# EAGLE schematic esp_test (EAGLE 7.7.0)
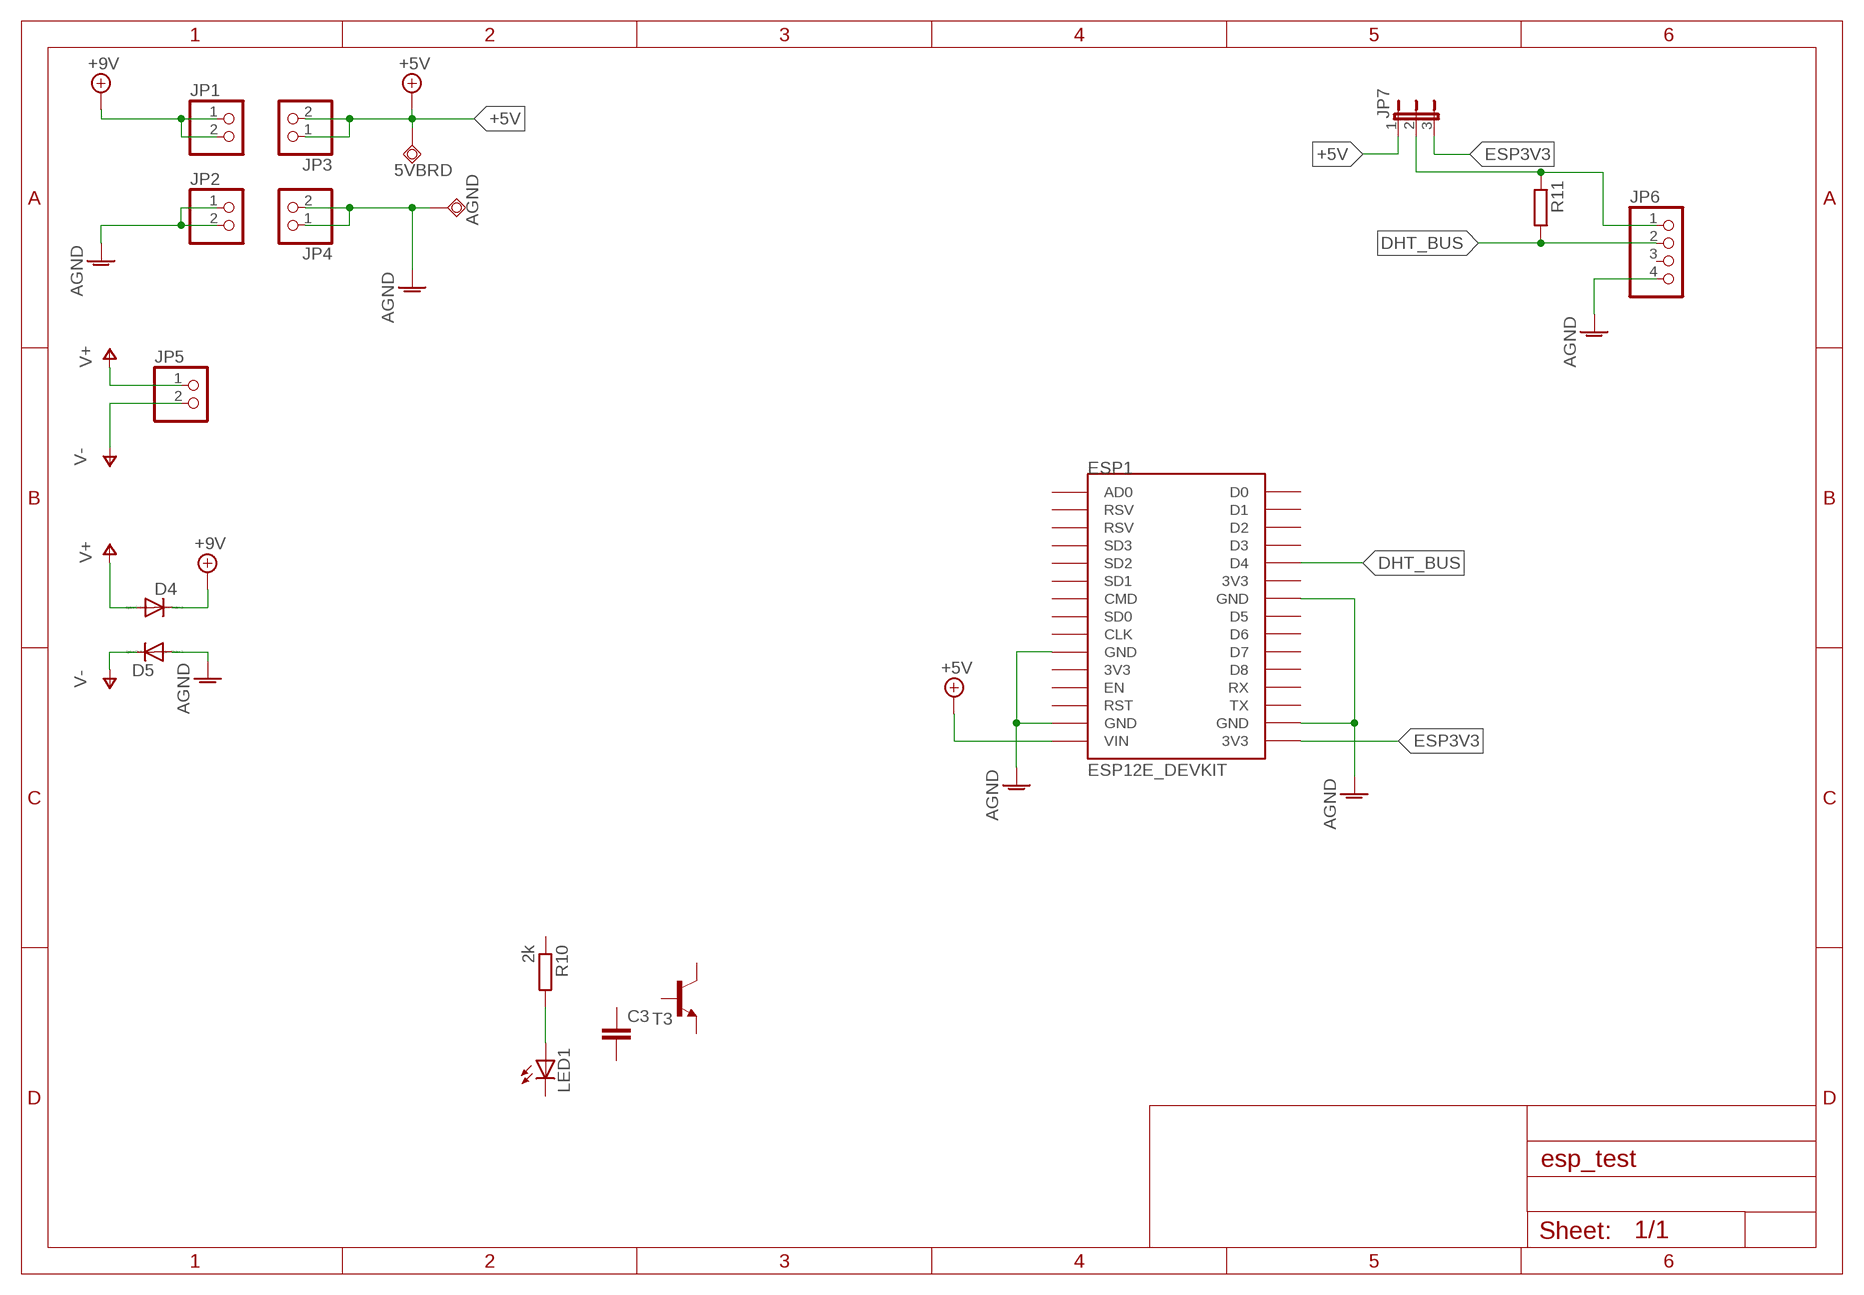
[diagram p0: schematic, sheet 1]

## Parts
5VBRD  TPSQTP20SQ  [TP20SQ]
AGND  TPSQTP20SQ  [TP20SQ]
C3  C-EUC1210  [C1210]
D4  1N4148DO35-7  [DO35-7]
D5  1N4148DO35-7  [DO35-7]
ESP1  ESP12E_DEVKIT  [ESP12E_DEVKIT]
JP1  PINHD-1X2  [1X02]
JP2  PINHD-1X2  [1X02]
JP3  PINHD-1X2  [1X02]
JP4  PINHD-1X2  [1X02]
JP5  PINHD-1X2  [1X02]
JP6  PINHD-1X4  [1X04]
JP7  JP2E  [JP2]
LED1  LED3MM  [LED3MM]
R10  2k  R-EU_R0805  [R0805]
R11  R-EU_R0805  [R0805]
T3  BC547-NPN-TO92-CBE  [TO92-CBE]

## Nets
+5V: 5VBRD.TP ESP1.VIN ESP1.VIN1(VIN) JP3.1 JP3.2 JP7.1
+9V: D4.C JP1.1 JP1.2
AGND: AGND.TP D5.A ESP1.GND@0(GND) ESP1.GND@1(GND) ESP1.GND@2(GND) ESP1.GND@3(GND) ESP1.GND@4(GND) ESP1.GND@5(GND) ESP1.GND@6(GND) ESP1.GND@7(GND) JP2.1 JP2.2 JP4.1 JP4.2 JP6.4
DHT_BUS: ESP1.D4 ESP1.D41(D4) JP6.2 R11.2
DHT_PWR: JP6.1 JP7.2 R11.1
ESP3V3: ESP1.3V3@2(3V3) JP7.3
N$33: LED1.A R10.2
V+: D4.A JP5.1
V-: D5.C JP5.2
Unconnected: C3.1 C3.2 ESP1.3V3@0(3V3) ESP1.3V3@1(3V3) ESP1.3V3@3(3V3) ESP1.3V3@4(3V3) ESP1.3V3@5(3V3) ESP1.AD0 ESP1.AD1(AD0) ESP1.CLK ESP1.CLK1(CLK) ESP1.CMD ESP1.CMD1(CMD) ESP1.D0 ESP1.D1 ESP1.D01(D0) ESP1.D2 ESP1.D3 ESP1.D5 ESP1.D6 ESP1.D7 ESP1.D8 ESP1.D11(D1) ESP1.D21(D2) ESP1.D31(D3) ESP1.D51(D5) ESP1.D61(D6) ESP1.D71(D7) ESP1.D81(D8) ESP1.EN ESP1.EN1(EN) ESP1.RST ESP1.RST1(RST) ESP1.RSV@0(RSV) ESP1.RSV@1(RSV) ESP1.RSV@01(RSV) ESP1.RSV@11(RSV) ESP1.RX ESP1.RX1(RX) ESP1.SD0 ESP1.SD1 ESP1.SD01(SD0) ESP1.SD2 ESP1.SD3 ESP1.SD12(SD1) ESP1.SD22(SD2) ESP1.SD32(SD3) ESP1.TX ESP1.TX1(TX) JP6.3 LED1.K(C) R10.1 T3.B T3.C T3.E

## Library data of the parts
5VBRD AGND = testpad:TPSQ: Test pad
C3 = rcl:C-EU: CAPACITOR, European symbol
D4 D5 = diode:1N4148: DIODE high speed (Philips)
ESP1 = ESP12E_DEVKIT:ESP12E_DEVKIT: ESP12E DEVKIT BOARD
JP1-JP5 = pinhead:PINHD-1X2: PIN HEADER
JP6 = pinhead:PINHD-1X4: PIN HEADER
JP7 = jumper:JP2E: JUMPER
LED1 = led:LED: LED OSRAM: - CHIPLED LG R971, LG N971, LY N971, LG Q971, LY Q971, LO R971, LY R971 LH N974, LH R974 LS Q976, LO Q976, LY Q976 LO Q996 - Hyper CHIPLED LW Q18S LB Q993, LB Q99A, LB R99A - SideLED LS A670, LO A670, LY A670, LG A670, LP A670 LB A673, LV A673, LT A673, LW A673 LH A674 LY A675 LS A676, LA A676, LO A676, LY A676, LW A676 LS A679, LY A679, LG A679 - Hyper Micro SIDELED® LS Y876, LA Y876, LO Y876, LY Y876 LT Y87S - SmartLED LW L88C, LW L88S LB L89C, LB L89S, LG L890 LS L89K, LO L89K, LY L89K LS L896, LA L896, LO L896, LY L896 - TOPLED LS T670, LO T670, LY T670, LG T670, LP T670 LSG T670, LSP T670, LSY T670, LOP T670, LYG T670 LG T671, LOG T671, LSG T671 LB T673, LV T673, LT T673, LW T673 LH T674 LS T676, LA T676, LO T676, LY T676, LB T676, LH T676, LSB T676, LW T676 LB T67C, LV T67C, LT T67C, LS T67K, LO T67K, LY T67K, LW E67C LS E67B, LA E67B, LO E67B, LY E67B, LB E67C, LV E67C, LT E67C LW T67C LS T679, LY T679, LG T679 LS T770, LO T770, LY T770, LG T770, LP T770 LB T773, LV T773, LT T773, LW T773 LH T774 LS E675, LA E675, LY E675, LS T675 LS T776, LA T776, LO T776, LY T776, LB T776 LHGB T686 LT T68C, LB T68C - Hyper Mini TOPLED® LB M676 - Mini TOPLED Santana® LG M470 LS M47K, LO M47K, LY M47K Source: http://www.osram.convergy.de LUXEON: - LUMILED® LXK2-PW12-R00, LXK2-PW12-S00, LXK2-PW14-U00, LXK2-PW14-V00 LXK2-PM12-R00, LXK2-PM12-S00, LXK2-PM14-U00 LXK2-PE12-Q00, LXK2-PE12-R00, LXK2-PE12-S00, LXK2-PE14-T00, LXK2-PE14-U00 LXK2-PB12-K00, LXK2-PB12-L00, LXK2-PB12-M00, LXK2-PB14-N00, LXK2-PB14-P00, LXK2-PB14-Q00 LXK2-PR12-L00, LXK2-PR12-M00, LXK2-PR14-Q00, LXK2-PR14-R00 LXK2-PD12-Q00, LXK2-PD12-R00, LXK2-PD12-S00 LXK2-PH12-R00, LXK2-PH12-S00 LXK2-PL12-P00, LXK2-PL12-Q00, LXK2-PL12-R00 Source: www.luxeon.com KINGBRIGHT: KA-3528ASYC Source: www.kingbright.com
R10 R11 = rcl:R-EU_: RESISTOR, European symbol
T3 = transistor:*-NPN-: NPN Transistror BF959 corrected 2008.03.06